# EAGLE schematic Circuit (EAGLE 9.6.2)
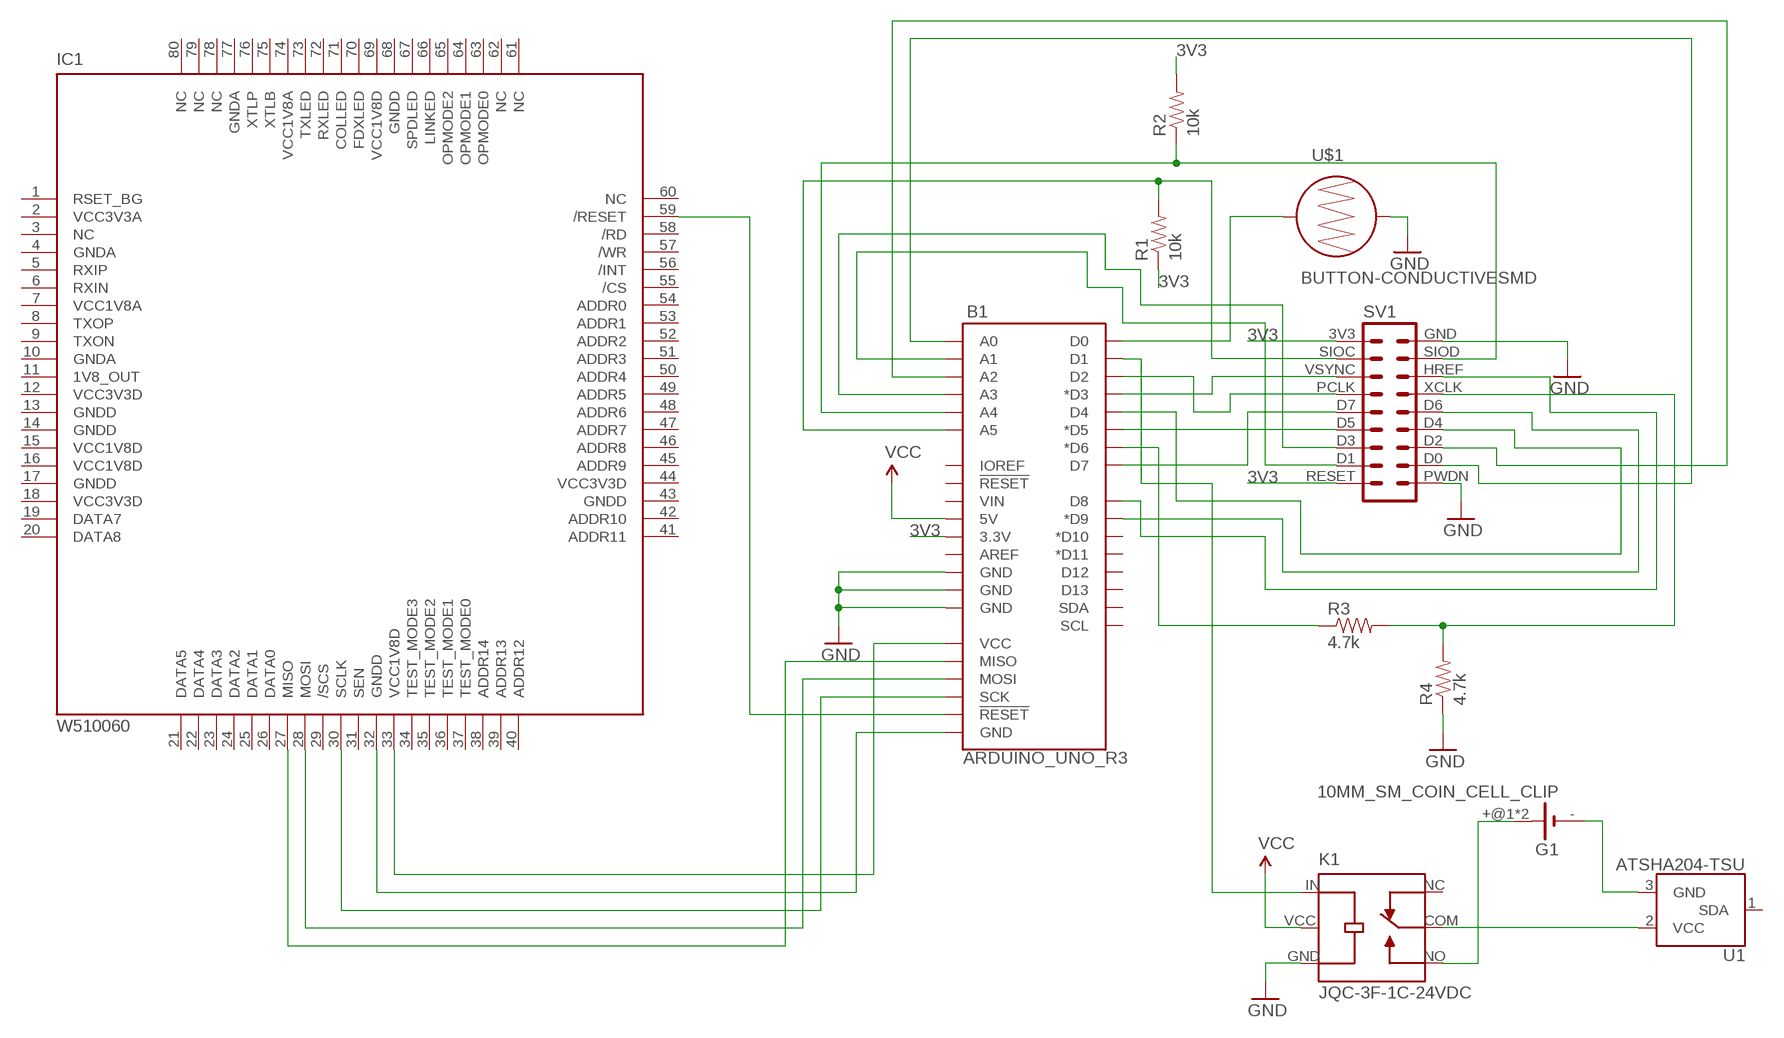
[diagram p0: schematic, sheet 1]

## Parts
B1  ARDUINO_UNO_R3  [ARDUINO_R3]
G1  10MM_SM_COIN_CELL_CLIP  [10MM_SM_COIN_CELL_CLIP]
IC1  W510060  [W5100]
K1  JQC-3F-1C-24VDC  [RELAY_JQC-3F-1C-24VDC]
R1  10k  RESISTOR0402  [0402-RES]
R2  10k  RESISTOR0402  [0402-RES]
R3  4.7k  RESISTOR0402  [0402-RES]
R4  4.7k  RESISTOR0402  [0402-RES]
SV1  ML16L  [ML16L]
U1  ATSHA204-TSU  [SOT23-3]
U$1  BUTTON-CONDUCTIVESMD  [BUTTON-CONDUCTIVE]

## Nets
3V3: B1.3.3V R1.1 R2.2 SV1.3V3 SV1.RESET
GND: B1.GND@2(GND) B1.GND@3(GND) B1.GND@4(GND) K1.GND R4.1 SV1.GND SV1.PWDN U$1.2
N$1: B1.A4 R2.1 SV1.SIOD
N$2: B1.D3(*D3) SV1.VSYNC
N$3: B1.A5 R1.2 SV1.SIOC
N$4: B1.D8 SV1.HREF
N$5: B1.D2 SV1.PCLK
N$6: R3.2 R4.2 SV1.XCLK
N$7: B1.D1 K1.IN
N$8: B1.D7 SV1.D7
N$9: B1.D5(*D5) SV1.D5
N$10: B1.D9(*D9) SV1.D6
N$11: B1.D4 SV1.D4
N$12: B1.A2 SV1.D2
N$13: B1.A0 SV1.D0
N$14: B1.A3 SV1.D3
N$15: B1.A1 SV1.D1
N$16: B1.MISO IC1.27(MISO)
N$17: B1.MOSI IC1.28(MOSI)
N$18: B1.SCK IC1.30(SCLK)
N$19: B1.GND@1(GND) IC1.32(GNDD)
N$20: B1.VCC IC1.33(VCC1V8D)
N$21: B1.RESET@2(!RESET!) IC1.59(/RESET)
N$22: G1.- U1.3(GND)
N$23: G1.+@1(+) G1.+@2(+) K1.NO
N$24: B1.D6(*D6) R3.1
N$25: B1.D0 U$1.1
N$26: K1.COM U1.2(VCC)
VCC: B1.5V K1.VCC
Unconnected: B1.AREF B1.D10(*D10) B1.D11(*D11) B1.D12 B1.D13 B1.IOREF B1.RESET@1(!RESET!) B1.SCL B1.SDA B1.VIN IC1.1(RSET_BG) IC1.2(VCC3V3A) IC1.3(NC) IC1.4(GNDA) IC1.5(RXIP) IC1.6(RXIN) IC1.7(VCC1V8A) IC1.8(TXOP) IC1.9(TXON) IC1.10(GNDA) IC1.12(VCC3V3D) IC1.13(GNDD) IC1.14(GNDD) IC1.15(VCC1V8D) IC1.16(VCC1V8D) IC1.17(GNDD) IC1.18(VCC3V3D) IC1.19(DATA7) IC1.20(DATA8) IC1.21(DATA5) IC1.22(DATA4) IC1.23(DATA3) IC1.24(DATA2) IC1.25(DATA1) IC1.26(DATA0) IC1.29(/SCS) IC1.34(TEST_MODE3) IC1.35(TEST_MODE2) IC1.36(TEST_MODE1) IC1.37(TEST_MODE0) IC1.38(ADDR14) IC1.39(ADDR13) IC1.40(ADDR12) IC1.41(ADDR11) IC1.42(ADDR10) IC1.43(GNDD) IC1.44(VCC3V3D) IC1.45(ADDR9) IC1.46(ADDR8) IC1.47(ADDR7) IC1.49(ADDR5) IC1.50(ADDR4) IC1.52(ADDR2) IC1.53(ADDR1) IC1.54(ADDR0) IC1.55(/CS) IC1.56(/INT) IC1.57(/WR) IC1.58(/RD) IC1.60(NC) IC1.61(NC) IC1.62(NC) IC1.63(OPMODE0) IC1.64(OPMODE1) IC1.65(OPMODE2) IC1.66(LINKED) IC1.67(SPDLED) IC1.68(GNDD) IC1.69(VCC1V8D) IC1.72(RXLED) IC1.73(TXLED) IC1.74(VCC1V8A) IC1.75(XTLB) IC1.76(XTLP) IC1.77(GNDA) IC1.78(NC) IC1.79(NC) IC1.80(NC) K1.NC U1.1(SDA)

## Power pins joined to a net without a drawn wire
1V8_OUT: IC1.11(1V8_OUT)
ADDR3: IC1.51(ADDR3)
ADDR6: IC1.48(ADDR6)
COLLED: IC1.71(COLLED)
FDXLED: IC1.70(FDXLED)
SEN: IC1.31(SEN)

## Library data of the parts
B1 = SparkFun-Boards:ARDUINO_UNO_R3: Arduino R3 Footprint with SPI header Arduino Uno R3 Compatible Footprint. Matches PCB size of the original board. SparkFun Products: SAMD21 Dev Breakout <https://www.sparkfun.com/products/13672> RedBoard <https://www.sparkfun.com/products/12757> R3 Stackable Headers <https://www.sparkfun.com/products/11417>
G1 = battery:10MM_SM_COIN_CELL_CLIP: Battery cell clip for CR927 Source: KEYSTONE ELECTRONICS CORP. www.keyelco.com, ASTORIA, N.Y. 11105-2017 PART ANME 10mm SM COIN CELl CLIP DWG NO. 3030
IC1 = ethernet:W5100: PIC18F97J60 Family 64/80/100-Pin High-Performance, 1-Mbit Flash Microcontrollers with Ethernet Source: http://ww1.microchip.com/downloads/en/DeviceDoc/39762d.pdf; MPN: PIC18F86J60-I/PT; OC_FARNELL: unknown; OC_NEWARK: 56K7306
K1 = JQC-3F-1C-24VDC:JQC-3F-1C-24VDC: Miniature PCB Relay 24VDC, 10A 250VAC, 15A 125VAC, 10A 250VAC Check prices <https://pricing.snapeda.com/parts/JQC-3F-1C-24VDC/YUEQING%20HENGWEI%20ELECTRONICS%20CO.%2CLTD./view-part?ref=eda>; AVAILABILITY: No availability data; DESCRIPTION: Miniature PCB Relay 24VDC, 10A 250VAC, 15A 125VAC, 10A 250VAC; MF: YUEQING HENGWEI ELECTRONICS CO.,LTD.; MP: JQC-3F-1C-24VDC; PACKAGE: Package; PRICE: None
R1-R4 = SparkFun-Resistors:RESISTOR: Resistor Basic schematic elements and footprints for 0603, 1206, and PTH resistors.
SV1 = ov7670:ML16L: HARTING; OC_FARNELL: unknown; OC_NEWARK: unknown
U1 = SparkFun-IC-Special-Function:ATSHA204: Atmel ATSHA204 The Atmel ATSHA204 is an optimized authentication chip that includes a 4.5Kb EEPROM. This array can be used for storage of keys, miscellaneous read/write, read-only, password or secret data, and consumption tracking. Access to the various sections of memory can be restricted in a variety of ways and then the configuration locked to prevent changes. Datasheet <http://www.atmel.com/Images/Atmel-8740-CryptoAuth-ATSHA204-Datasheet.pdf> SparkFun Products SparkFun Electric Imp Shield <https://www.sparkfun.com/products/12887> SparkFun Electric Imp Breakout <https://www.sparkfun.com/products/12886>; PROD_ID: IC-11208
U$1 = SparkFun-Electromechanical:BUTTON-CONDUCTIVE: Used with rubber key pads. This one was designed and proven to work with the PolyCase Key FOB enclosures.